# Altium project PIXRACER-R12.PrjPCB
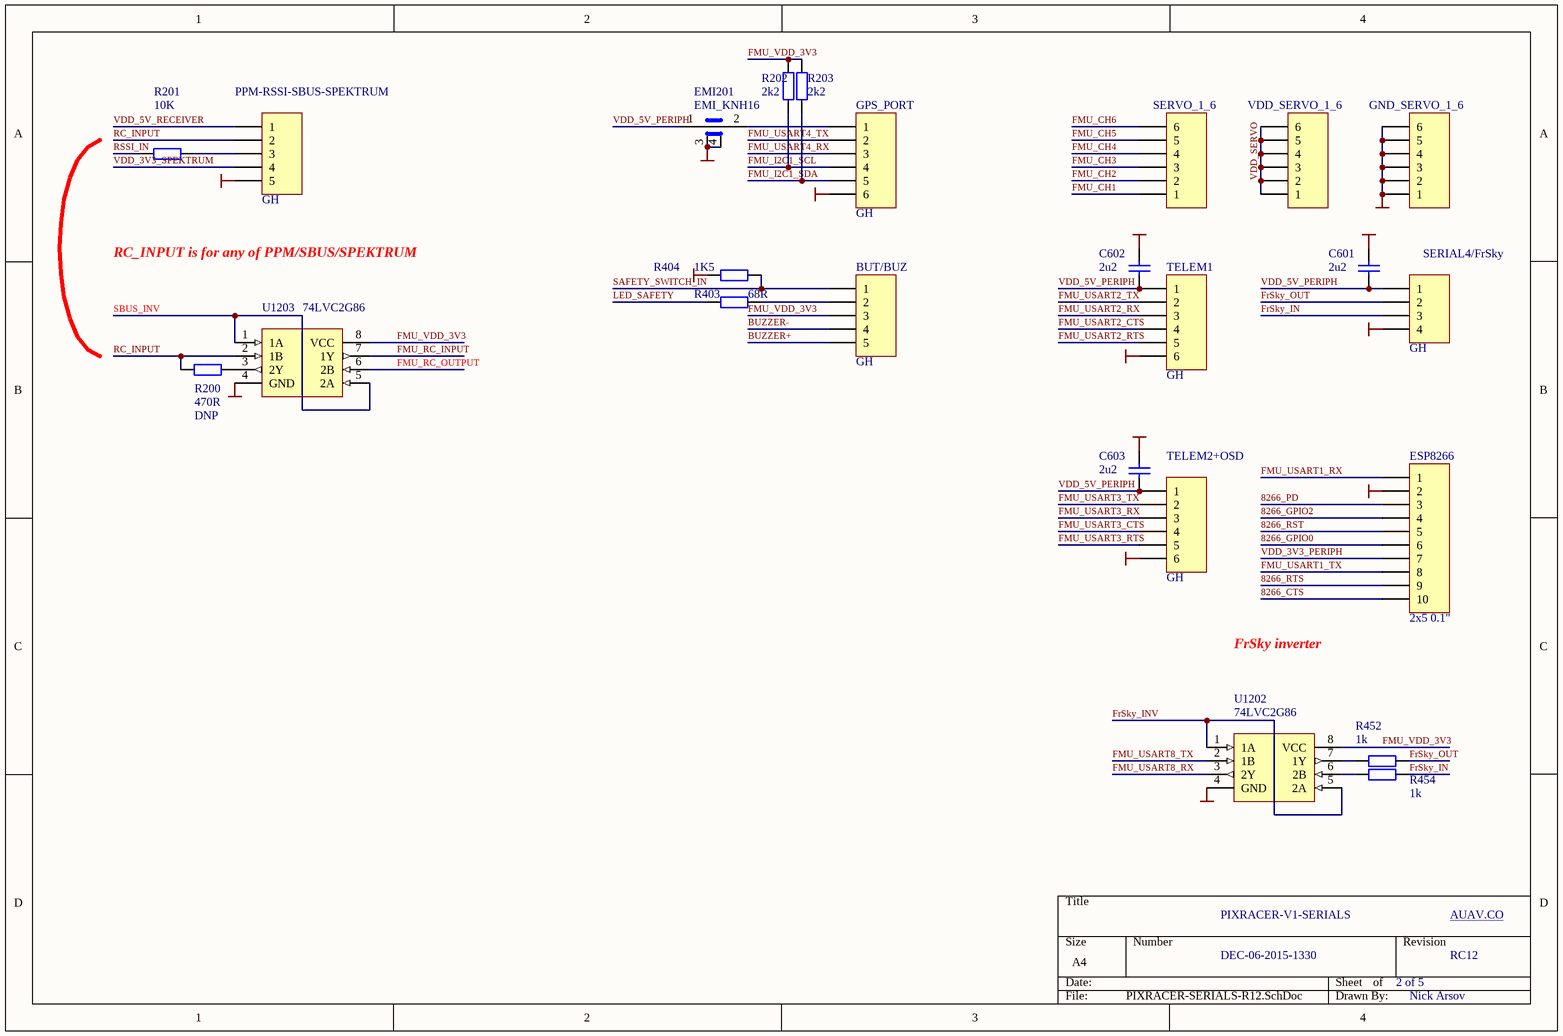
[diagram p0: PIXRACER-SERIALS-R12.SchDoc]
5 sheets, 138 parts. Net scope: global (net labels, ports and power ports of the same name join across sheets).
Board file: PIXRACER-R12.PcbDoc
Sheets:
  PIXRACER-SERIALS-R12.SchDoc
  PIXRACER-SD-USB-R12.SchDoc
  PIXRACER-POWER-R12.SchDoc
  PIXRACER-FMU-R12.SchDoc
  PIXRACER-IMU-R12.SchDoc

## Sheet PIXRACER-SERIALS-R12.SchDoc
size A4

### Parts
BUT/BUZ  GH  [Molex_Clik_1.25_5H]
C601  2u2  [0402A]
C602  2u2  [0402A]
C603  2u2  [0402A]
EMI201  EMI_KNH16  [EMI_KNH16_0603]
ESP8266  2x5 0.1"  [2.54mm_10pin_SMD]
GND_SERVO_1_6  Header 6  [HDR1X6]  (value not drawn)
GPS_PORT  GH  [Molex_Clok_1.25_6H]
PPM-RSSI-SBUS-SPEKTRUM  GH  [Molex_Clik_1.25_5H]
R200  470R  REM: DNP  [0402A]
R201  10K  [0402A]
R202  2k2  [0402A]
R203  2k2  [0402A]
R403  68R  [0402A]
R404  1K5  [0402A]
R452  1k  [0402A]
R454  1k  [0402A]
SERIAL4/FrSky  GH  [Molex_1.25_click_4]
SERVO_1_6  Header 6  [HDR1X6]  (value not drawn)
TELEM1  GH  [Molex_Clok_1.25_6H]
TELEM2+OSD  GH  [Molex_Clok_1.25_6H]
U1202  74LVC2G86  [DCU(SM-8)]
U1203  74LVC2G86  [DCU(SM-8)]
VDD_SERVO_1_6  Header 6  [HDR1X6]  (value not drawn)

### Nets
FMU_VDD_3V3: BUT/BUZ.3 R202.1 R203.1 U1202.8(VCC) U1203.8(VCC)
GND: C601.2 C602.2 C603.2 EMI201.3(G) EMI201.4(G) ESP8266.2 GND_SERVO_1_6.1 GND_SERVO_1_6.2 GND_SERVO_1_6.3 GND_SERVO_1_6.4 GND_SERVO_1_6.5 GND_SERVO_1_6.6 GPS_PORT.6 PPM-RSSI-SBUS-SPEKTRUM.5 R404.2 SERIAL4/FrSky.4 TELEM1.6 TELEM2+OSD.6 U1202.4(GND) U1203.4(GND)
8266_CTS: ESP8266.10
8266_GPIO0: ESP8266.6
8266_GPIO2: ESP8266.4
8266_PD: ESP8266.3
8266_RST: ESP8266.5
8266_RTS: ESP8266.9
BUZZER+: BUT/BUZ.5
BUZZER-: BUT/BUZ.4
FMU_CH1: SERVO_1_6.1
FMU_CH2: SERVO_1_6.2
FMU_CH3: SERVO_1_6.3
FMU_CH4: SERVO_1_6.4
FMU_CH5: SERVO_1_6.5
FMU_CH6: SERVO_1_6.6
FMU_I2C1_SCL: GPS_PORT.4 R202.2
FMU_I2C1_SDA: GPS_PORT.5 R203.2
FMU_RC_INPUT: U1203.7(1Y)
FMU_RC_OUTPUT: U1203.6(2B)
FMU_USART1_RX: ESP8266.1
FMU_USART1_TX: ESP8266.8
FMU_USART2_CTS: TELEM1.4
FMU_USART2_RTS: TELEM1.5
FMU_USART2_RX: TELEM1.3
FMU_USART2_TX: TELEM1.2
FMU_USART3_CTS: TELEM2+OSD.4
FMU_USART3_RTS: TELEM2+OSD.5
FMU_USART3_RX: TELEM2+OSD.3
FMU_USART3_TX: TELEM2+OSD.2
FMU_USART4_RX: GPS_PORT.3
FMU_USART4_TX: GPS_PORT.2
FMU_USART8_RX: U1202.3(2Y)
FMU_USART8_TX: U1202.2(1B)
FrSky_IN: R454.1 SERIAL4/FrSky.3
FrSky_INV: U1202.1(1A) U1202.5(2A)
FrSky_OUT: R452.1 SERIAL4/FrSky.2
LED_SAFETY: R403.2
RC_INPUT: PPM-RSSI-SBUS-SPEKTRUM.2 R200.2 U1203.2(1B)
RSSI_IN: R201.2
SAFETY_SWITCH_IN: BUT/BUZ.1 R404.1
SBUS_INV: U1203.1(1A) U1203.5(2A)
VDD_3V3_PERIPH: ESP8266.7
VDD_3V3_SPEKTRUM: PPM-RSSI-SBUS-SPEKTRUM.4
VDD_5V_PERIPH: C601.1 C602.1 C603.1 EMI201.1(L1) SERIAL4/FrSky.1 TELEM1.1 TELEM2+OSD.1
VDD_5V_RECEIVER: PPM-RSSI-SBUS-SPEKTRUM.1
VDD_SERVO: VDD_SERVO_1_6.1 VDD_SERVO_1_6.2 VDD_SERVO_1_6.3 VDD_SERVO_1_6.4 VDD_SERVO_1_6.5 VDD_SERVO_1_6.6
NetBUT/BUZ_2: BUT/BUZ.2 R403.1
NetEMI201_2: EMI201.2(L2) GPS_PORT.1
NetPPM-RSSI-SBUS-SPEKTRUM_3: PPM-RSSI-SBUS-SPEKTRUM.3 R201.1
NetR200_1: R200.1 U1203.3(2Y)
NetR452_2: R452.2 U1202.7(1Y)
NetR454_2: R454.2 U1202.6(2B)

### Notes on the sheet
- RC_INPUT is for any of PPM/SBUS/SPEKTRUM
- FrSky inverter
- PIXRACER-V1-SERIALS
- AUAV.CO
- DEC-06-2015-1330
- 2 of 5
- RC12
- Nick Arsov

### Library data of the parts
BUT/BUZ PPM-RSSI-SBUS-SPEKTRUM = Header 5: Header, 5-Pin; LatestRevisionDate: 17-Jul-2002; LatestRevisionNote: Re-released for DXP Platform.; Publisher: Altium Limited
C601-C603 = Cap: Capacitor; Value: 100pF; Published: 8-Jun-2000; LatestRevisionDate: 17-Jul-2002; LatestRevisionNote: Re-released for DXP Platform.; PackageReference: RAD-0.3; Publisher: Altium Limited
ESP8266 = Header 10: Header, 10-Pin; LatestRevisionDate: 17-Jul-2002; LatestRevisionNote: Re-released for DXP Platform.; Publisher: Altium Limited
GND_SERVO_1_6 GPS_PORT SERVO_1_6 TELEM1 TELEM2+OSD VDD_SERVO_1_6 = Header 6: Header, 6-Pin; LatestRevisionDate: 17-Jul-2002; LatestRevisionNote: Re-released for DXP Platform.; Publisher: Altium Limited
R200-R203 R403 R404 = Res2: Resistor; Value: 1K; Published: 8-Jun-2000; LatestRevisionDate: 17-Jul-2002; LatestRevisionNote: Re-released for DXP Platform.; PackageReference: AXIAL-0.4; Publisher: Altium Limited
  R202 R203: PackageDescription: Axial Device, Thru-Hole; 2 Leads; 0.4 in Pin Spacing
R452 R454 = Res2: Resistor; Published: 8-Jun-2000; LatestRevisionDate: 17-Jul-2002; LatestRevisionNote: Re-released for DXP Platform.; PackageReference: AXIAL-0.4; Publisher: Altium Limited; PackageDescription: Axial Device, Thru-Hole; 2 Leads; 0.4 in Pin Spacing; Value: 1K
SERIAL4/FrSky = Header 4: Header, 4-Pin; LatestRevisionDate: 17-Jul-2002; LatestRevisionNote: Re-released for DXP Platform.; Publisher: Altium Limited

## Sheet PIXRACER-SD-USB-R12.SchDoc
size A4
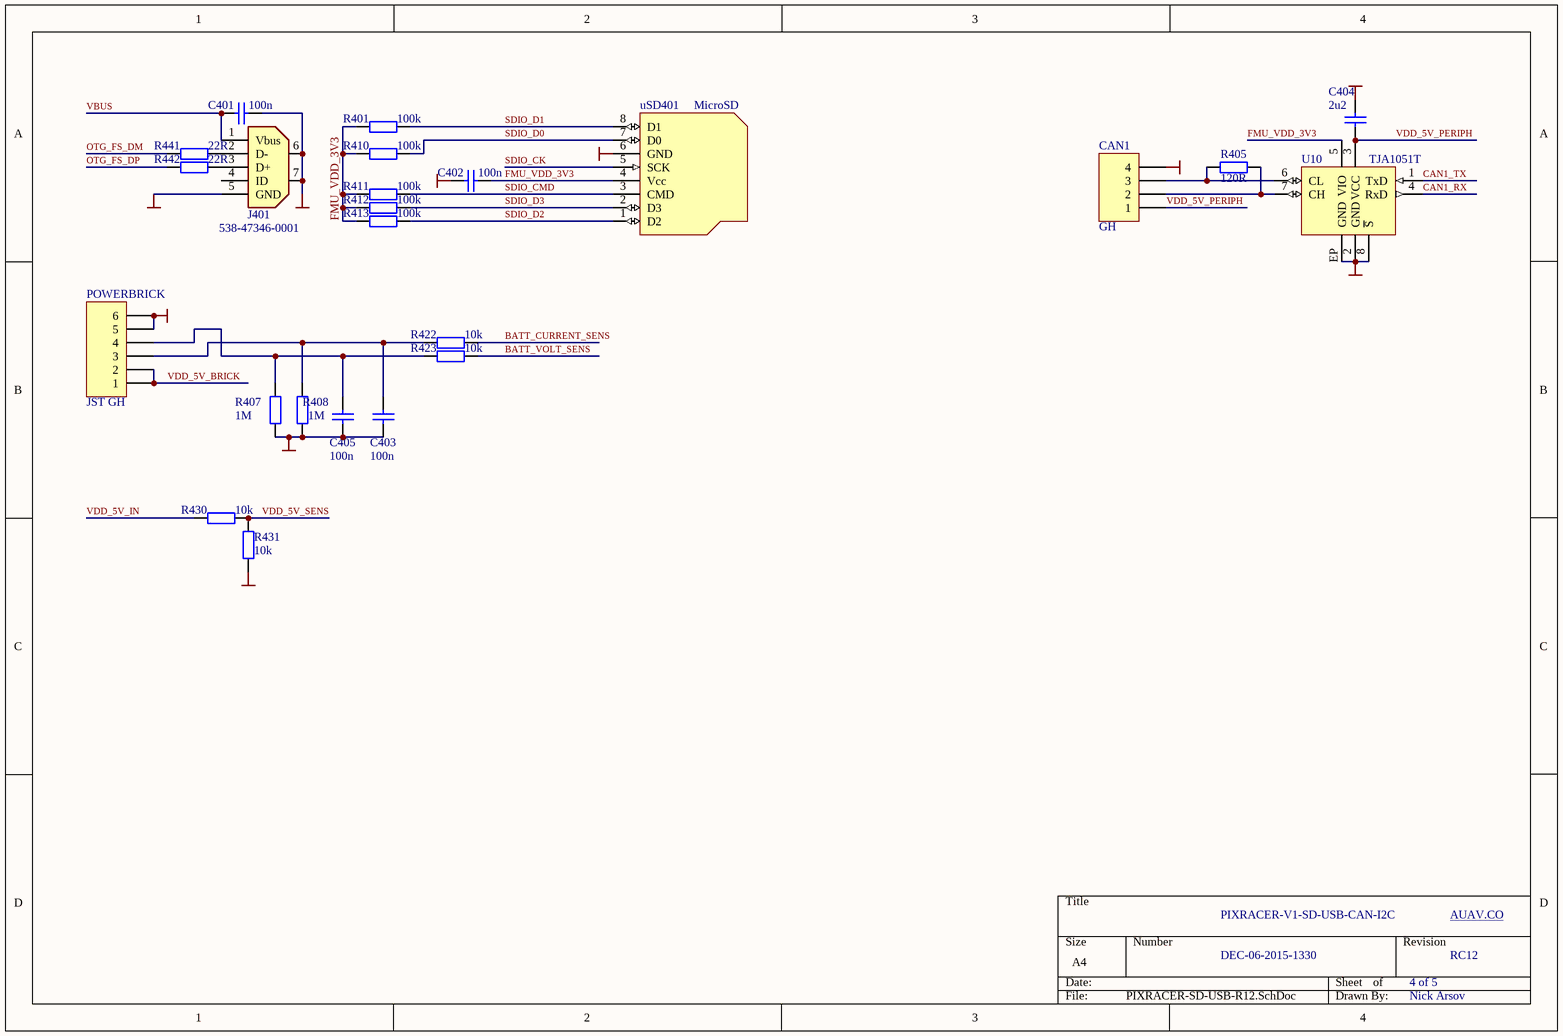
[diagram p1: PIXRACER-SD-USB-R12.SchDoc]

### Parts
C401  100n  [0402A]
C402  100n  [0402A]
C403  100n  [0402A]
C404  2u2  [0603A]
C405  100n  [0402A]
CAN1  GH  [Molex_1.25_click_4]
J401  Mouser Part Number: 538-47346-0001  [USBmicro_B]  (hidden comment: miniUSB)
POWERBRICK  JST GH  [Molex_Clok_1.25_6H]
R401  100k  [0402A]
R405  120R  [0603A]
R407  1M  [0402A]
R408  1M  [0402A]
R410  100k  [0402A]
R411  100k  [0402A]
R412  100k  [0402A]
R413  100k  [0402A]
R422  10k  [0402A]
R423  10k  [0402A]
R430  10k  [0402A]
R431  10k  [0402A]
R441  22R  [0402A]
R442  22R  [0402A]
U10  TJA1051T  [8DFN_3x3]
uSD401  MicroSD  [MicroSD_China_01]

### Nets
FMU_VDD_3V3: C402.1 R401.2 R410.2 R411.2 R412.2 R413.2 U10.5(VIO) uSD401.4(Vcc)
GND: C401.1 C402.2 C403.2 C404.1 C405.2 CAN1.4 J401.5(GND) J401.6(GND) J401.7(GND) POWERBRICK.5 POWERBRICK.6 R407.2 R408.2 R431.2 U10.2(GND) U10.8(~{S}) U10.EP(GND) uSD401.6(GND)
BATT_CURRENT_SENS: R422.1
BATT_VOLT_SENS: R423.1
CAN1_RX: U10.4(RxD)
CAN1_TX: U10.1(TxD)
OTG_FS_DM: R441.2
OTG_FS_DP: R442.2
SDIO_CK: uSD401.5(SCK)
SDIO_CMD: R411.1 uSD401.3(CMD)
SDIO_D0: R410.1 uSD401.7(D0)
SDIO_D1: R401.1 uSD401.8(D1)
SDIO_D2: R413.1 uSD401.1(D2)
SDIO_D3: R412.1 uSD401.2(D3)
VBUS: C401.2 J401.1(Vbus)
VDD_5V_BRICK: POWERBRICK.1 POWERBRICK.2
VDD_5V_IN: R430.2
VDD_5V_PERIPH: C404.2 CAN1.1 U10.3(VCC)
VDD_5V_SENS: R430.1 R431.1
NetC403_1: C403.1 POWERBRICK.3 R408.1 R422.2
NetC405_1: C405.1 POWERBRICK.4 R407.1 R423.2
NetCAN1_2: CAN1.2 R405.1 U10.7(CH)
NetCAN1_3: CAN1.3 R405.2 U10.6(CL)
NetJ401_2: J401.2(D-) R441.1
NetJ401_3: J401.3(D+) R442.1

Not connected (* = marked no-connect by the designer): J401 4(ID)

### Notes on the sheet
- PIXRACER-V1-SD-USB-CAN-I2C
- AUAV.CO
- DEC-06-2015-1330
- 4 of 5
- RC12
- Nick Arsov

### Library data of the parts
C401-C405 = Cap: Capacitor; Value: 100pF; Published: 8-Jun-2000; LatestRevisionDate: 17-Jul-2002; LatestRevisionNote: Re-released for DXP Platform.; PackageReference: RAD-0.3; Publisher: Altium Limited
CAN1 = Header 4: Header, 4-Pin; LatestRevisionDate: 17-Jul-2002; LatestRevisionNote: Re-released for DXP Platform.; Publisher: Altium Limited
J401 = MicroUSB
POWERBRICK = Header 6: Header, 6-Pin; LatestRevisionDate: 17-Jul-2002; LatestRevisionNote: Re-released for DXP Platform.; Publisher: Altium Limited
R401 R405 R407 R408 R410-R413 R422 R423 R430 R431 R441 R442 = Res2: Resistor; Value: 1K; Published: 8-Jun-2000; LatestRevisionDate: 17-Jul-2002; LatestRevisionNote: Re-released for DXP Platform.; PackageReference: AXIAL-0.4; Publisher: Altium Limited
  R401 R407 R408 R410-R413 R422 R423 R430 R431 R441 R442: PackageDescription: Axial Device, Thru-Hole; 2 Leads; 0.4 in Pin Spacing

## Sheet PIXRACER-POWER-R12.SchDoc
size A4
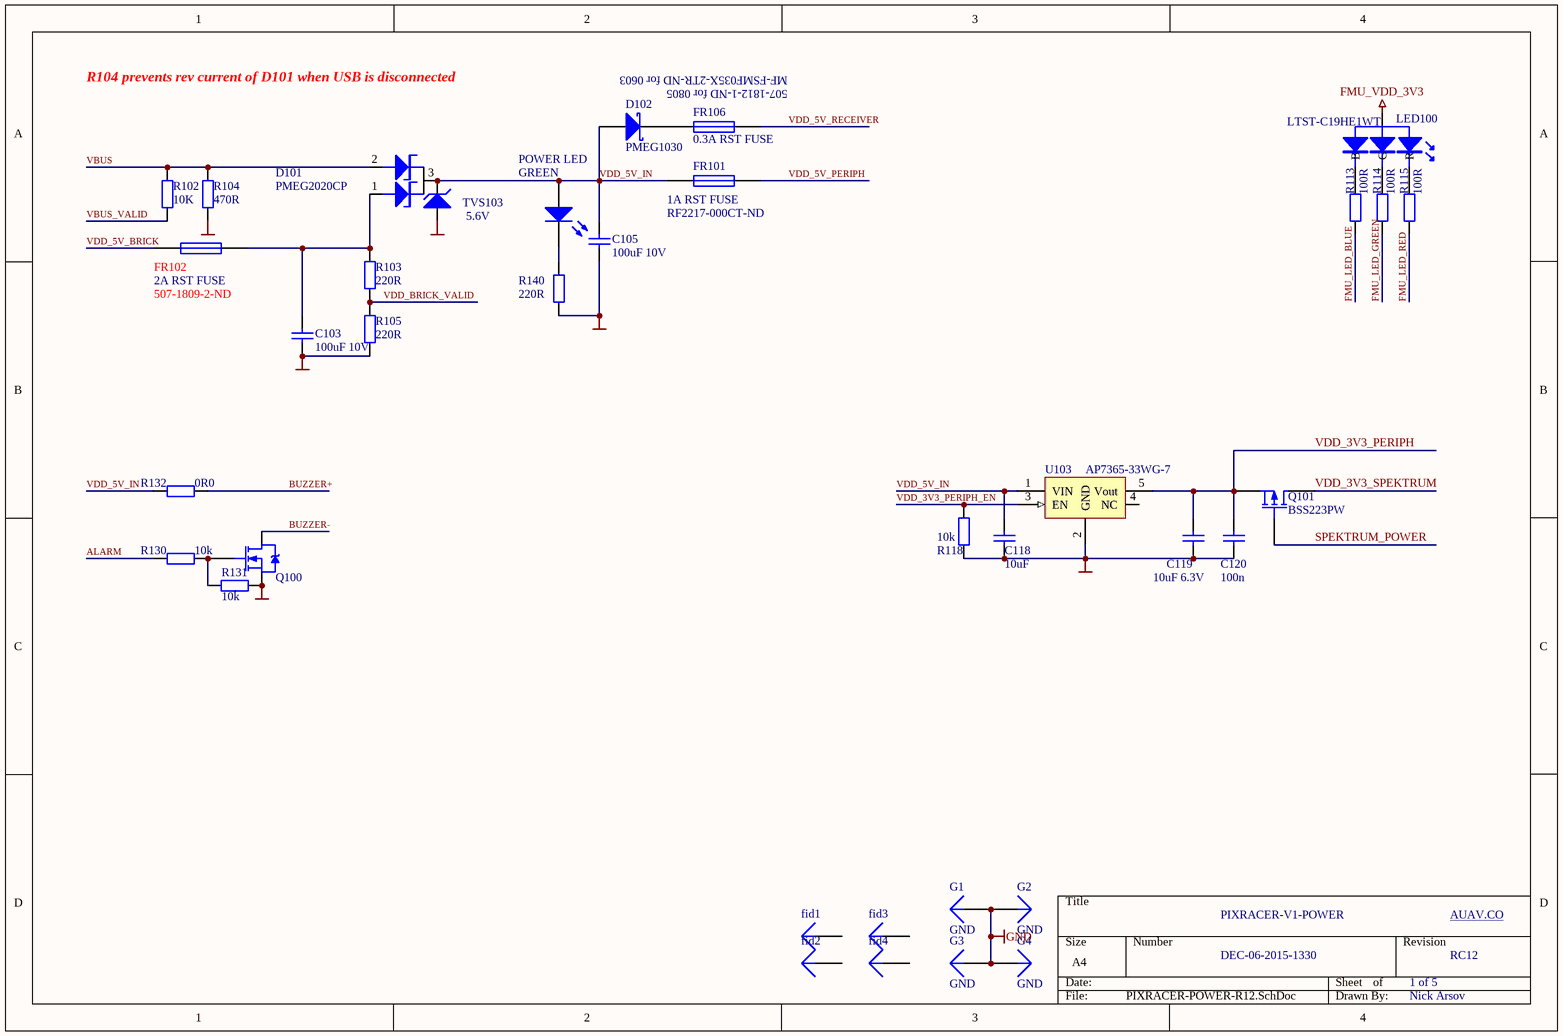
[diagram p2: PIXRACER-POWER-R12.SchDoc]

### Parts
C103  100uF 10V  [0805A]
C105  100uF 10V  [0805A]
C118  10uF  [0603A]
C119  10uF 6.3V  [0603A]
C120  100n  [0603A]
D101  PMEG2020CP  [pmeg2020cp]
D102  PMEG1030  [sod323f]
fid1  (no value)  [SMT_PAD]
fid2  (no value)  [SMT_PAD]
fid3  (no value)  [SMT_PAD]
fid4  (no value)  [SMT_PAD]
FR101  1A RST FUSE  DigiKey: RF2217-000CT-ND  [0805A]
FR102  2A RST FUSE  DigiKey: 507-1809-2-ND  [1206A]
FR106  0.3A RST FUSE  [0805A]
G1  GND
G2  GND
G3  GND
G4  GND
LED100  LTST-C19HE1WT  [LTST-C19HE1WT]
POWER_LED  GREEN  [0603A]
Q100  DMG1012UW  [2N7002-SOT323]  (value not drawn)
Q101  BSS223PW  [2N7002-SOT323]
R102  10K  [0603A]
R103  220R  [0603A]
R104  470R  [0603A]
R105  220R  [0603A]
R113  100R  [0402A]
R114  100R  [0402A]
R115  100R  [0402A]
R118  10k  [0603A]
R130  10k  [0402A]
R131  10k  [0402A]
R132  0R0  [0402A]
R140  220R  [0603A]
TVS103  5.6V  [SOD123F]
U103  AP7365-33WG-7  [SOT23-5]

### Nets
FMU_VDD_3V3: LED100.4(A)
GND: C103.1 C105.1 C118.1 C119.1 C120.1 G1.1 G2.1 G3.1 G4.1 Q100.2(S) R104.1 R105.2 R118.1 R131.2 R140.1 TVS103.1(A) U103.2(GND)
ALARM: R130.2
BUZZER+: R132.1
BUZZER-: Q100.1(D)
FMU_LED_BLUE: R113.1
FMU_LED_GREEN: R114.1
FMU_LED_RED: R115.1
SPEKTRUM_POWER: Q101.3(G)
VBUS: D101.2 R102.2 R104.2
VBUS_VALID: R102.1
VDD_3V3_PERIPH: C119.2 C120.2 Q101.2(S) U103.5(Vout)
VDD_3V3_PERIPH_EN: R118.2 U103.3(EN)
VDD_3V3_SPEKTRUM: Q101.1(D)
VDD_5V_BRICK: FR102.1
VDD_5V_IN: C105.2 C118.2 D101.3 D102.1(A) FR101.1 POWER_LED.1(A) R132.2 TVS103.2(K) U103.1(VIN)
VDD_5V_PERIPH: FR101.2
VDD_5V_RECEIVER: FR106.2
VDD_BRICK_VALID: R103.2 R105.1
NetC103_2: C103.2 D101.1 FR102.2 R103.1
NetD102_2: D102.2(K) FR106.1
NetLED100_1: LED100.1(R) R115.2
NetLED100_2: LED100.2(G) R114.2
NetLED100_3: LED100.3(B) R113.2
NetPOWER_LED_2: POWER_LED.2(K) R140.2
NetQ100_3: Q100.3(G) R130.1 R131.1

Not connected (* = marked no-connect by the designer): fid1 1; fid2 1; fid3 1; fid4 1; U103 4(NC)

### Notes on the sheet
- R104 prevents rev current of D101 when USB is disconnected
- 507-1812-1-ND for 0805
- MF-FSMF035X-2TR-ND for 0603
- PIXRACER-V1-POWER
- AUAV.CO
- DEC-06-2015-1330
- 1 of 5
- RC12
- Nick Arsov

### Library data of the parts
C103 C105 C118-C120 = Cap: Capacitor; Value: 100pF; Published: 8-Jun-2000; LatestRevisionDate: 17-Jul-2002; LatestRevisionNote: Re-released for DXP Platform.; PackageReference: RAD-0.3; Publisher: Altium Limited; PackageDescription: Radial Cap, Thru-Hole; 2 Leads; 0.3 in Pin Spacing
D102 = D Schottky: Schottky Diode; Published: 8-Jun-2000; LatestRevisionDate: 17-Jul-2002; LatestRevisionNote: Re-released for DXP Platform.; PackageReference: SMB; Publisher: Altium Limited; PackageDescription: DO-214-AA/SMB; 2 C-Bend Leads; Body 5.3 x 3.6 mm, inc. leads (LxW); Code_JEDEC: DO-214-AA
fid1-fid4 G1-G4 = Plug: LatestRevisionDate: 17-Jul-2002; LatestRevisionNote: Re-released for DXP Platform.; Publisher: Altium Limited
FR101 FR102 FR106 = Fuse 1: Fuse; Published: 8-Jun-2000; LatestRevisionDate: 17-Jul-2002; LatestRevisionNote: Re-released for DXP Platform.; PackageReference: PIN-W2/E2.8; Publisher: Altium Limited; PackageDescription: Thru-Hole; 2 Leads
LED100 = RGB_LED_5MM
POWER_LED = LED0: Typical INFRARED GaAs LED; Published: 8-Jun-2000; LatestRevisionDate: 08-Jul-2005; LatestRevisionNote: Mech Layer 1 removed.; PackageReference: LED-0; Publisher: Altium Limited; PackageDescription: LED; 2 Leads
Q100 = NMOS-2: N-Channel Power MOSFET; Note: Pin 2 is electrically connected to pin 4.; Published: 8-Jun-2000; LatestRevisionDate: 17-Jul-2002; LatestRevisionNote: Re-released for DXP Platform.; DatasheetDocument: PD-9.814; PackageReference: TO-220AB; Publisher: Altium Limited; Code_JEDEC: TO-220-AB; ComponentLink1Description: Manufacturer Link; ComponentLink1URL: http://www.irf.com/
Q101 = MOSFET-P: P-Channel MOSFET; Published: 8-Jun-2000; LatestRevisionDate: 17-Jul-2002; LatestRevisionNote: Re-released for DXP Platform.; PackageVersion: 1995/1996; PackageReference: E3; Publisher: Altium Limited; PackageDescription: TO, Flat Index; 3 In-Line, Axial Leads; Body Dia. 4.6mm; Lead Dia. 0.5 mm (max)
R102-R105 R113-R115 R118 R130-R132 R140 = Res2: Resistor; Value: 1K; Published: 8-Jun-2000; LatestRevisionDate: 17-Jul-2002; LatestRevisionNote: Re-released for DXP Platform.; PackageReference: AXIAL-0.4; Publisher: Altium Limited
  R102-R105 R118 R130-R132 R140: PackageDescription: Axial Device, Thru-Hole; 2 Leads; 0.4 in Pin Spacing
TVS103 = D Zener: Zener Diode; Published: 8-Jun-2000; LatestRevisionDate: 17-Jul-2002; LatestRevisionNote: Re-released for DXP Platform.; PackageReference: DIODE-0.7; Publisher: Altium Limited; PackageDescription: Diode, Thru-Hole; 2 Leads; 0.7 in Pin Spacing
U103 = LP5907-Q1

## Sheet PIXRACER-FMU-R12.SchDoc
size A4
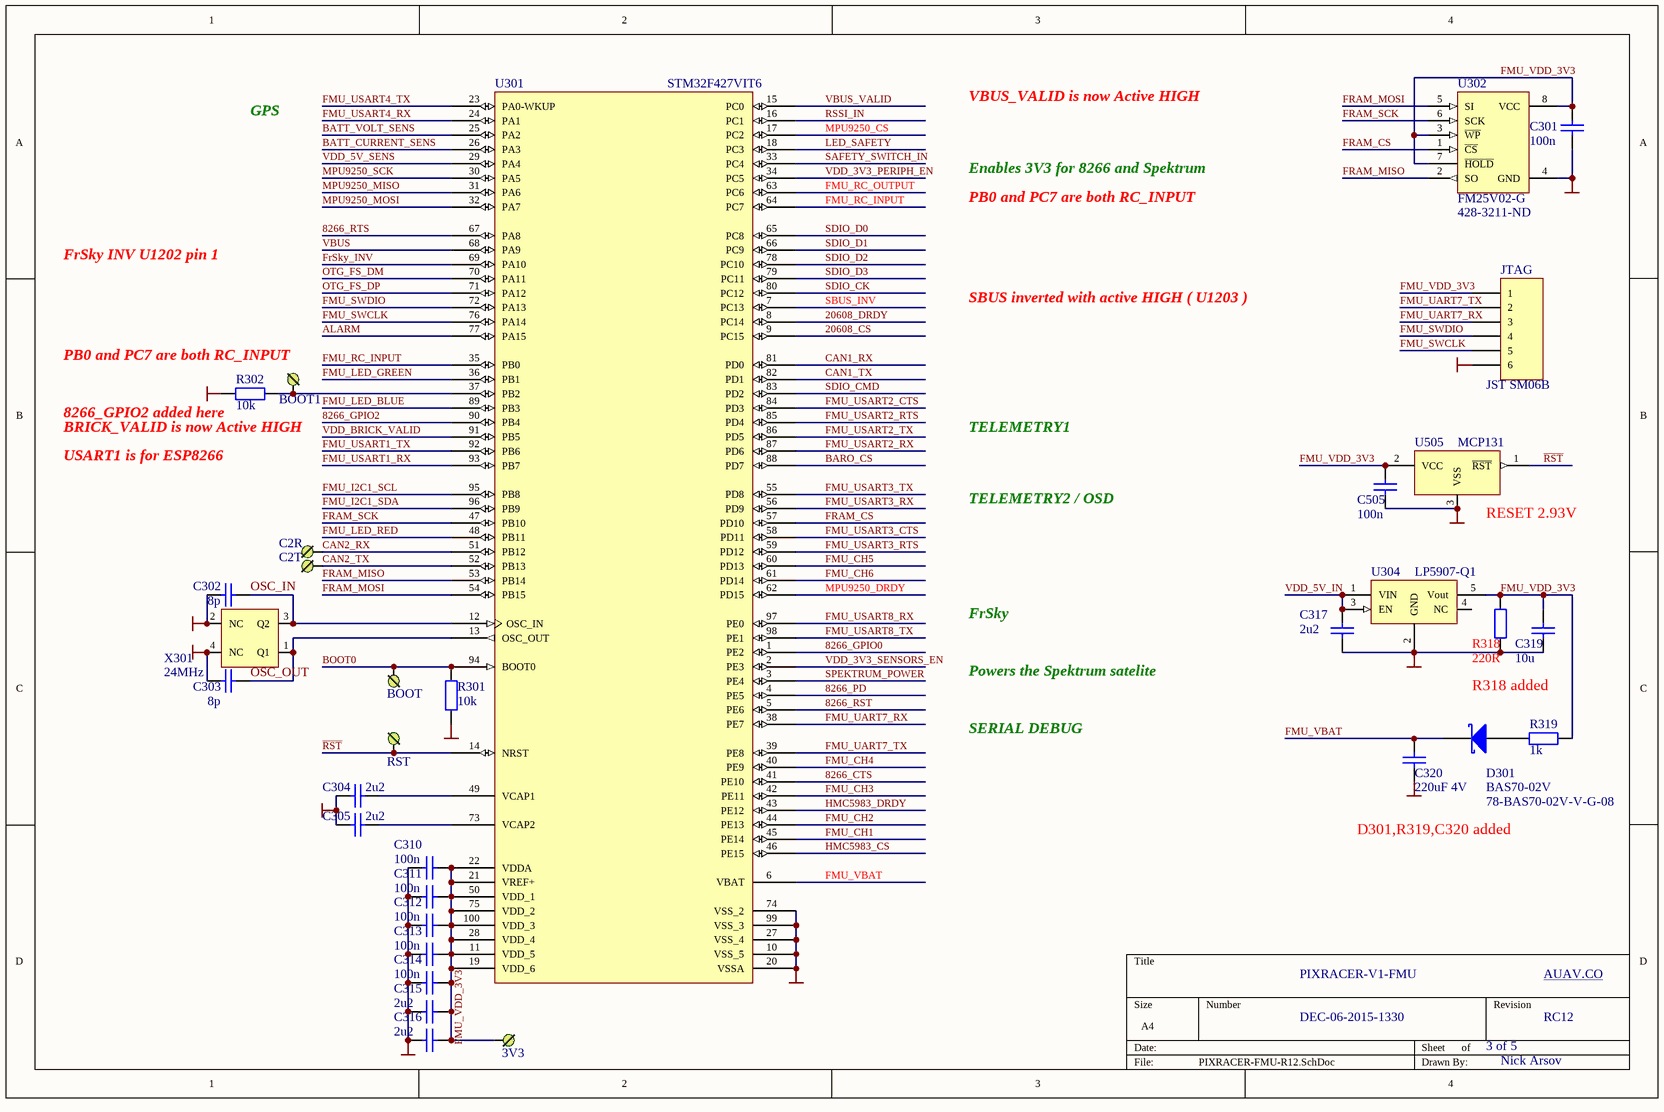
[diagram p3: PIXRACER-FMU-R12.SchDoc]

### Parts
3V3  3V3  [PAD1]  (value not drawn)
BOOT  BOOT  [PAD1]  (value not drawn)
BOOT1  BOOT1  [PAD1]  (value not drawn)
C2R  CAN2_RX  [PAD1]  (value not drawn)
C2T  CAN2_TX  [PAD1]  (value not drawn)
C301  100n  [0402A]
C302  8p  [0603A]
C303  8p  [0603A]
C304  2u2  [0402A]
C305  2u2  [0402A]
C310  100n  [0402A]
C311  100n  [0402A]
C312  100n  [0402A]
C313  100n  [0402A]
C314  100n  [0402A]
C315  2u2  [0402A]
C316  2u2  [0402A]
C317  2u2  [0603A]
C319  10u  [0603A]
C320  220uF 4V  [1206A]
C505  100n  [0402A]
D301  BAS70-02V  Mouser: 78-BAS70-02V-V-G-08  [SOD-523]
JTAG  JST SM06B  [SM06B-SRSH-TB]
R301  10k  [0402A]
R302  10k  [0402A]
R318  220R  [0603A]
R319  1k  [0603A]
RST  BOOT  [PAD1]  (value not drawn)
U301  STM32F427VIT6  [LQFP100_L]
U302  FM25V02-G  Supplier Part Number: 428-3211-ND  [SO-8_N]
U304  LP5907-Q1  [SOT23-5]
U505  MCP131  [SOT-323]
X301  24MHz  [Crystal_2.5x2]

### Nets
FMU_VDD_3V3: 3V3.1 C301.2 C310.2 C311.2 C312.2 C313.2 C314.2 C315.2 C316.2 C319.2 C505.2 JTAG.1 R318.2 R319.1 U301.11(VDD_5) U301.19(VDD_6) U301.21(VREF+) U301.22(VDDA) U301.28(VDD_4) U301.50(VDD_1) U301.75(VDD_2) U301.100(VDD_3) U302.3(~{WP}) U302.7(~{HOLD}) U302.8(VCC) U304.5(Vout) U505.2(VCC)
GND: C301.1 C302.1 C303.1 C304.2 C305.2 C310.1 C311.1 C312.1 C313.1 C314.1 C315.1 C316.1 C317.1 C319.1 C320.1 C505.1 JTAG.6 R301.2 R302.1 R318.1 U301.10(VSS_5) U301.20(VSSA) U301.27(VSS_4) U301.74(VSS_2) U301.99(VSS_3) U302.4(GND) U304.2(GND) U505.3(VSS) X301.2(NC) X301.4(NC)
8266_CTS: U301.41(PE10)
8266_GPIO0: U301.1(PE2)
8266_GPIO2: U301.90(PB4)
8266_PD: U301.4(PE5)
8266_RST: U301.5(PE6)
8266_RTS: U301.67(PA8)
20608_CS: U301.9(PC15)
20608_DRDY: U301.8(PC14)
~{RST}: RST.1 U301.14(NRST) U505.1(~{RST})
ALARM: U301.77(PA15)
BARO_CS: U301.88(PD7)
BATT_CURRENT_SENS: U301.26(PA3)
BATT_VOLT_SENS: U301.25(PA2)
BOOT0: BOOT.1 R301.1 U301.94(BOOT0)
CAN1_RX: U301.81(PD0)
CAN1_TX: U301.82(PD1)
CAN2_RX: C2R.1 U301.51(PB12)
CAN2_TX: C2T.1 U301.52(PB13)
FMU_CH1: U301.45(PE14)
FMU_CH2: U301.44(PE13)
FMU_CH3: U301.42(PE11)
FMU_CH4: U301.40(PE9)
FMU_CH5: U301.60(PD13)
FMU_CH6: U301.61(PD14)
FMU_I2C1_SCL: U301.95(PB8)
FMU_I2C1_SDA: U301.96(PB9)
FMU_LED_BLUE: U301.89(PB3)
FMU_LED_GREEN: U301.36(PB1)
FMU_LED_RED: U301.48(PB11)
FMU_RC_INPUT: U301.35(PB0) U301.64(PC7)
FMU_RC_OUTPUT: U301.63(PC6)
FMU_SWCLK: JTAG.5 U301.76(PA14)
FMU_SWDIO: JTAG.4 U301.72(PA13)
FMU_UART7_RX: JTAG.3 U301.38(PE7)
FMU_UART7_TX: JTAG.2 U301.39(PE8)
FMU_USART1_RX: U301.93(PB7)
FMU_USART1_TX: U301.92(PB6)
FMU_USART2_CTS: U301.84(PD3)
FMU_USART2_RTS: U301.85(PD4)
FMU_USART2_RX: U301.87(PD6)
FMU_USART2_TX: U301.86(PD5)
FMU_USART3_CTS: U301.58(PD11)
FMU_USART3_RTS: U301.59(PD12)
FMU_USART3_RX: U301.56(PD9)
FMU_USART3_TX: U301.55(PD8)
FMU_USART4_RX: U301.24(PA1)
FMU_USART4_TX: U301.23(PA0-WKUP)
FMU_USART8_RX: U301.97(PE0)
FMU_USART8_TX: U301.98(PE1)
FMU_VBAT: C320.2 D301.2(K) U301.6(VBAT)
FRAM_CS: U301.57(PD10) U302.1(~{CS})
FRAM_MISO: U301.53(PB14) U302.2(SO)
FRAM_MOSI: U301.54(PB15) U302.5(SI)
FRAM_SCK: U301.47(PB10) U302.6(SCK)
FrSky_INV: U301.69(PA10)
HMC5983_CS: U301.46(PE15)
HMC5983_DRDY: U301.43(PE12)
LED_SAFETY: U301.18(PC3)
MPU9250_CS: U301.17(PC2)
MPU9250_DRDY: U301.62(PD15)
MPU9250_MISO: U301.31(PA6)
MPU9250_MOSI: U301.32(PA7)
MPU9250_SCK: U301.30(PA5)
OSC_IN: C302.2 U301.12(OSC_IN) X301.3(Q2)
OSC_OUT: C303.2 U301.13(OSC_OUT) X301.1(Q1)
OTG_FS_DM: U301.70(PA11)
OTG_FS_DP: U301.71(PA12)
RSSI_IN: U301.16(PC1)
SAFETY_SWITCH_IN: U301.33(PC4)
SBUS_INV: U301.7(PC13)
SDIO_CK: U301.80(PC12)
SDIO_CMD: U301.83(PD2)
SDIO_D0: U301.65(PC8)
SDIO_D1: U301.66(PC9)
SDIO_D2: U301.78(PC10)
SDIO_D3: U301.79(PC11)
SPEKTRUM_POWER: U301.3(PE4)
VBUS: U301.68(PA9)
VBUS_VALID: U301.15(PC0)
VDD_3V3_PERIPH_EN: U301.34(PC5)
VDD_3V3_SENSORS_EN: U301.2(PE3)
VDD_5V_IN: C317.2 U304.1(VIN) U304.3(EN)
VDD_5V_SENS: U301.29(PA4)
VDD_BRICK_VALID: U301.91(PB5)
NetBOOT1_1: BOOT1.1 R302.2 U301.37(PB2)
NetC304_1: C304.1 U301.49(VCAP1)
NetC305_1: C305.1 U301.73(VCAP2)
NetD301_1: D301.1(A) R319.2

Not connected (* = marked no-connect by the designer): U304 4(NC)

### Notes on the sheet
- GPS
- VBUS_VALID is now Active HIGH
- Enables 3V3 for 8266 and Spektrum
- FrSky INV U1202 pin 1
- PB0 and PC7 are both RC_INPUT
- SBUS inverted with active HIGH ( U1203 )
- (near BOOT1) PB0 and PC7 are both RC_INPUT
- (near R302) USART1 is for ESP8266
- BRICK_VALID is now Active HIGH
- (near R302) 8266_GPIO2 added here
- TELEMETRY1
- TELEMETRY2 / OSD
- (near U505) RESET 2.93V
- FrSky
- Powers the Spektrum satelite
- R318 added
- SERIAL DEBUG
- D301,R319,C320 added
- PIXRACER-V1-FMU
- AUAV.CO
- DEC-06-2015-1330
- 3 of 5
- RC12
- Nick Arsov

### Library data of the parts
3V3 BOOT BOOT1 C2R C2T RST = PLUG
C301-C305 C310-C317 C319 C320 C505 = Cap: Capacitor; Value: 100pF; Published: 8-Jun-2000; LatestRevisionDate: 17-Jul-2002; LatestRevisionNote: Re-released for DXP Platform.; PackageReference: RAD-0.3; Publisher: Altium Limited
  C320: PackageDescription: Radial Cap, Thru-Hole; 2 Leads; 0.3 in Pin Spacing
D301 = D Schottky: Schottky Diode; Published: 8-Jun-2000; LatestRevisionDate: 17-Jul-2002; LatestRevisionNote: Re-released for DXP Platform.; PackageReference: SMB; Publisher: Altium Limited; PackageDescription: DO-214-AA/SMB; 2 C-Bend Leads; Body 5.3 x 3.6 mm, inc. leads (LxW); Code_JEDEC: DO-214-AA
JTAG = Header 6: Header, 6-Pin; LatestRevisionDate: 17-Jul-2002; LatestRevisionNote: Re-released for DXP Platform.; Publisher: Altium Limited
R301 R302 R318 = Res2: Resistor; Value: 1K; Published: 8-Jun-2000; LatestRevisionDate: 17-Jul-2002; LatestRevisionNote: Re-released for DXP Platform.; PackageReference: AXIAL-0.4; Publisher: Altium Limited; PackageDescription: Axial Device, Thru-Hole; 2 Leads; 0.4 in Pin Spacing
R319 = Res2: Resistor; Published: 8-Jun-2000; LatestRevisionDate: 17-Jul-2002; LatestRevisionNote: Re-released for DXP Platform.; PackageReference: AXIAL-0.4; Publisher: Altium Limited; PackageDescription: Axial Device, Thru-Hole; 2 Leads; 0.4 in Pin Spacing; Value: 1K
U301 = STM32F103VBT6: STM32 ARM-based 32-bit MCU with 64 Kbytes Flash, 100-pin LQFP, Industrial Temperature; Published: 30-May-2008; DatasheetVersion: rev6, Mar-2008; PackageVersion: Mar-2008; PackageReference: LQFP100; Publisher: Altium Limited; PackageDescription: 100-Pin Low-Profile Quad Flat Pack, 14 x 14 mm Body, 0.5 mm Pitch (LQFP100); ComponentLink1Description: Manufacturer Link; ComponentLink1URL: www.st.com/stm32; ComponentLink2Description: Datasheet; ComponentLink2URL: http://www.st.com/stonline/products/literature/ds/13587.pdf
U302 = AT45DB161D-MU
U505 = MCP102
X301 = Crystal_4pin: Supplier Part Number: 644-1052-1-ND

## Sheet PIXRACER-IMU-R12.SchDoc
size A4; PageSetup: Record=PageOptions|CenterHorizontal=True|CenterVertical=True|PrintScale=0.97|XCorrection=1.00|YCorrection=1.00|PrintKind=2|BorderSize=5000000|LeftOffset=0|BottomOffset=0|Orientation=2|PaperLength=1000|PaperWidth=1000|Scale=100|PaperSource=7|PrintQuality=-4|MediaType=1|DitherType=10|PaperKind=A4|PrintScaleMode=1
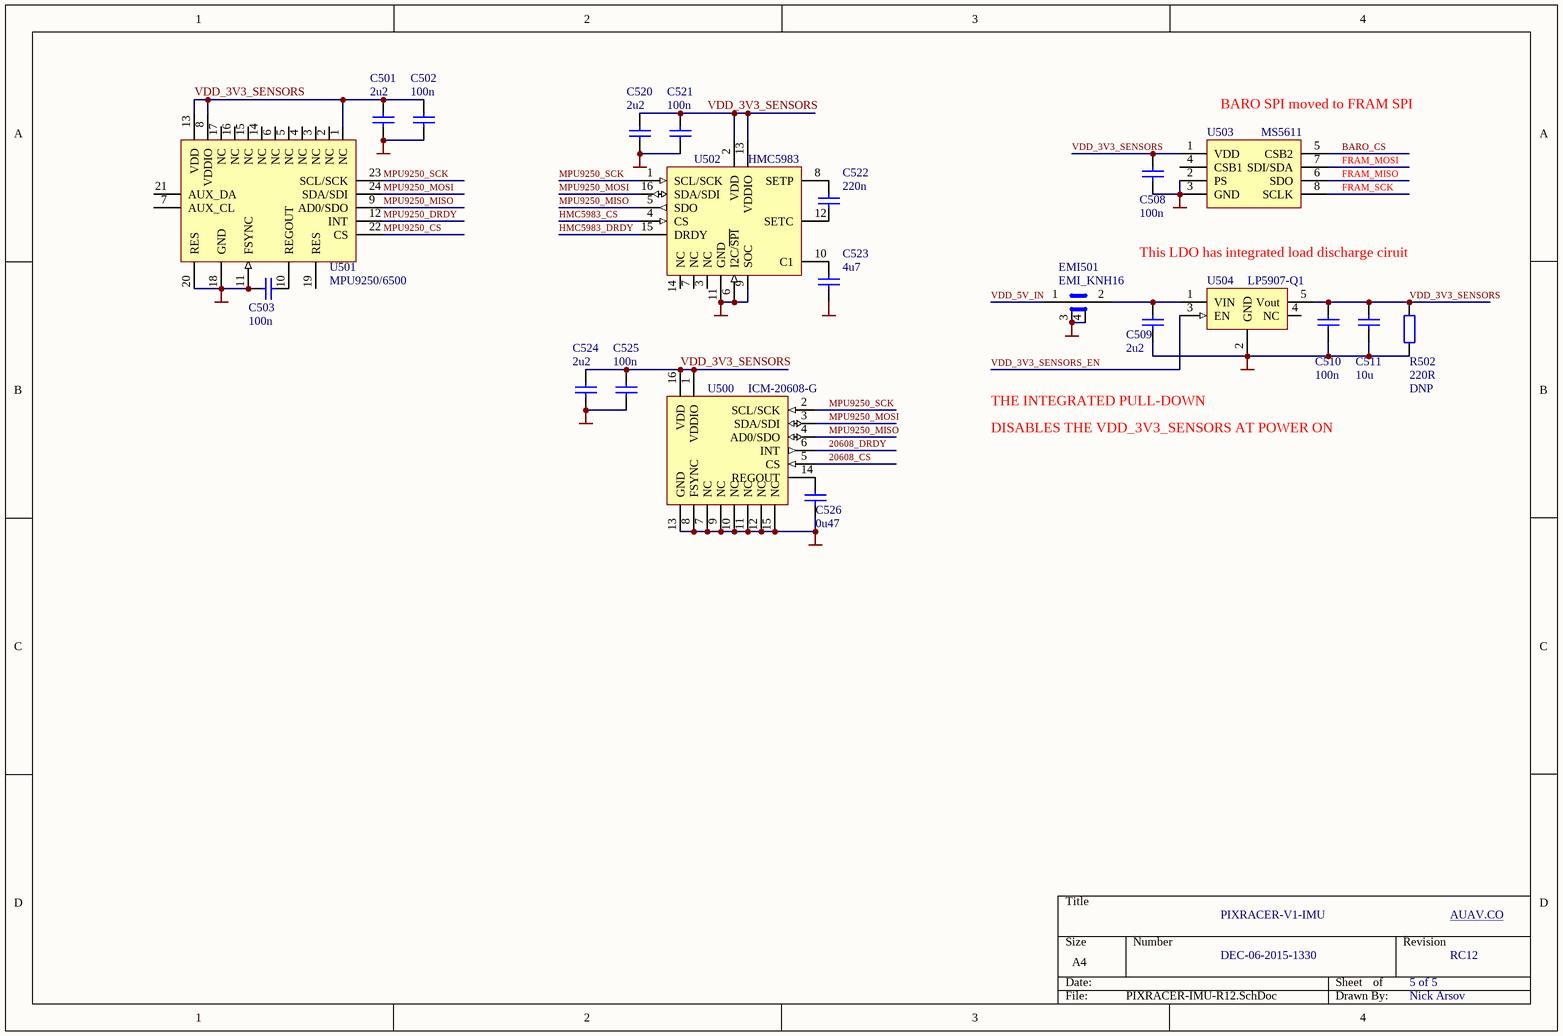
[diagram p4: PIXRACER-IMU-R12.SchDoc]

### Parts
C501  2u2  [0402A]
C502  100n  [0402A]
C503  100n  [0402A]
C508  100n  [0402A]
C509  2u2  [0603A]
C510  100n  [0603A]
C511  10u  [0603A]
C520  2u2  [0402A]
C521  100n  [0402A]
C522  220n  [0402A]
C523  4u7  [0603A]
C524  2u2  [0402A]
C525  100n  [0402A]
C526  0u47  [0402A]
EMI501  EMI_KNH16  [EMI_KNH16_0603]
R502  220R  REM: DNP  [0402A]
U500  ICM-20608-G  [HCLGA-16L]
U501  MPU9250/6500  [QFN24_3x3]
U502  HMC5983  [HMC5883L]
U503  MS5611  [MS5611]
U504  LP5907-Q1  [SOT23-5]

### Nets
GND: C501.1 C502.1 C503.1 C508.1 C509.1 C510.1 C511.1 C520.1 C521.1 C523.1 C524.1 C525.1 C526.1 EMI501.3(G) EMI501.4(G) R502.1 U500.7(NC) U500.8(FSYNC) U500.9(NC) U500.10(NC) U500.11(NC) U500.12(NC) U500.13(GND) U500.15(NC) U501.11(FSYNC) U501.18(GND) U501.20(RES) U502.6(I2C/~{SPI}) U502.9(SOC) U502.11(GND) U503.2(PS) U503.3(GND) U504.2(GND)
20608_CS: U500.5(CS)
20608_DRDY: U500.6(INT)
BARO_CS: U503.5(CSB2)
FRAM_MISO: U503.6(SDO)
FRAM_MOSI: U503.7(SDI/SDA)
FRAM_SCK: U503.8(SCLK)
HMC5983_CS: U502.4(CS)
HMC5983_DRDY: U502.15(DRDY)
MPU9250_CS: U501.22(CS)
MPU9250_DRDY: U501.12(INT)
MPU9250_MISO: U500.4(AD0/SDO) U501.9(AD0/SDO) U502.5(SDO)
MPU9250_MOSI: U500.3(SDA/SDI) U501.24(SDA/SDI) U502.16(SDA/SDI)
MPU9250_SCK: U500.2(SCL/SCK) U501.23(SCL/SCK) U502.1(SCL/SCK)
VDD_3V3_SENSORS: C501.2 C502.2 C508.2 C510.2 C511.2 C520.2 C521.2 C524.2 C525.2 R502.2 U500.1(VDDIO) U500.16(VDD) U501.1(NC) U501.8(VDDIO) U501.13(VDD) U502.2(VDD) U502.13(VDDIO) U503.1(VDD) U504.5(Vout)
VDD_3V3_SENSORS_EN: U504.3(EN)
VDD_5V_IN: EMI501.1(L1)
NetC503_2: C503.2 U501.10(REGOUT)
NetC509_2: C509.2 EMI501.2(L2) U504.1(VIN)
NetC522_1: C522.1 U502.12(SETC)
NetC522_2: C522.2 U502.8(SETP)
NetC523_2: C523.2 U502.10(C1)
NetC526_2: C526.2 U500.14(REGOUT)

Not connected (* = marked no-connect by the designer): U501 2(NC) 3(NC) 4(NC) 5(NC) 6(NC) 7(AUX_CL) 14(NC) 15(NC) 16(NC) 17(NC) 19(RES) 21(AUX_DA); U502 3(NC) 7(NC) 14(NC); U503 4(CSB1); U504 4(NC)

### Notes on the sheet
- (near U503) BARO SPI moved to FRAM SPI
- This LDO has integrated load discharge ciruit
- THE INTEGRATED PULL-DOWN
- DISABLES THE VDD_3V3_SENSORS AT POWER ON
- PIXRACER-V1-IMU
- AUAV.CO
- DEC-06-2015-1330
- 5 of 5
- RC12
- Nick Arsov

### Library data of the parts
C501-C503 C508-C511 C520-C526 = Cap: Capacitor; Value: 100pF; Published: 8-Jun-2000; LatestRevisionDate: 17-Jul-2002; LatestRevisionNote: Re-released for DXP Platform.; PackageReference: RAD-0.3; Publisher: Altium Limited
R502 = Res2: Resistor; Value: 1K; Published: 8-Jun-2000; LatestRevisionDate: 17-Jul-2002; LatestRevisionNote: Re-released for DXP Platform.; PackageReference: AXIAL-0.4; Publisher: Altium Limited; PackageDescription: Axial Device, Thru-Hole; 2 Leads; 0.4 in Pin Spacing
U501 = MPU6500
U503 = MS5611-01BA03

## Nets that join several sheets
FMU_VDD_3V3: PIXRACER-SERIALS-R12 (5 pins), PIXRACER-SD-USB-R12 (8 pins), PIXRACER-POWER-R12 (LED100.4), PIXRACER-FMU-R12 (27 pins)
GND: PIXRACER-SERIALS-R12 (20 pins), PIXRACER-SD-USB-R12 (18 pins), PIXRACER-POWER-R12 (17 pins), PIXRACER-FMU-R12 (30 pins), PIXRACER-IMU-R12 (33 pins)
8266_CTS: PIXRACER-SERIALS-R12 (ESP8266.10), PIXRACER-FMU-R12 (U301.41)
8266_GPIO0: PIXRACER-SERIALS-R12 (ESP8266.6), PIXRACER-FMU-R12 (U301.1)
8266_GPIO2: PIXRACER-SERIALS-R12 (ESP8266.4), PIXRACER-FMU-R12 (U301.90)
8266_PD: PIXRACER-SERIALS-R12 (ESP8266.3), PIXRACER-FMU-R12 (U301.4)
8266_RST: PIXRACER-SERIALS-R12 (ESP8266.5), PIXRACER-FMU-R12 (U301.5)
8266_RTS: PIXRACER-SERIALS-R12 (ESP8266.9), PIXRACER-FMU-R12 (U301.67)
20608_CS: PIXRACER-FMU-R12 (U301.9), PIXRACER-IMU-R12 (U500.5)
20608_DRDY: PIXRACER-FMU-R12 (U301.8), PIXRACER-IMU-R12 (U500.6)
ALARM: PIXRACER-POWER-R12 (R130.2), PIXRACER-FMU-R12 (U301.77)
BARO_CS: PIXRACER-FMU-R12 (U301.88), PIXRACER-IMU-R12 (U503.5)
BATT_CURRENT_SENS: PIXRACER-SD-USB-R12 (R422.1), PIXRACER-FMU-R12 (U301.26)
BATT_VOLT_SENS: PIXRACER-SD-USB-R12 (R423.1), PIXRACER-FMU-R12 (U301.25)
BUZZER+: PIXRACER-SERIALS-R12 (BUT/BUZ.5), PIXRACER-POWER-R12 (R132.1)
BUZZER-: PIXRACER-SERIALS-R12 (BUT/BUZ.4), PIXRACER-POWER-R12 (Q100.1)
CAN1_RX: PIXRACER-SD-USB-R12 (U10.4), PIXRACER-FMU-R12 (U301.81)
CAN1_TX: PIXRACER-SD-USB-R12 (U10.1), PIXRACER-FMU-R12 (U301.82)
FMU_CH1: PIXRACER-SERIALS-R12 (SERVO_1_6.1), PIXRACER-FMU-R12 (U301.45)
FMU_CH2: PIXRACER-SERIALS-R12 (SERVO_1_6.2), PIXRACER-FMU-R12 (U301.44)
FMU_CH3: PIXRACER-SERIALS-R12 (SERVO_1_6.3), PIXRACER-FMU-R12 (U301.42)
FMU_CH4: PIXRACER-SERIALS-R12 (SERVO_1_6.4), PIXRACER-FMU-R12 (U301.40)
FMU_CH5: PIXRACER-SERIALS-R12 (SERVO_1_6.5), PIXRACER-FMU-R12 (U301.60)
FMU_CH6: PIXRACER-SERIALS-R12 (SERVO_1_6.6), PIXRACER-FMU-R12 (U301.61)
FMU_I2C1_SCL: PIXRACER-SERIALS-R12 (GPS_PORT.4 R202.2), PIXRACER-FMU-R12 (U301.95)
FMU_I2C1_SDA: PIXRACER-SERIALS-R12 (GPS_PORT.5 R203.2), PIXRACER-FMU-R12 (U301.96)
FMU_LED_BLUE: PIXRACER-POWER-R12 (R113.1), PIXRACER-FMU-R12 (U301.89)
FMU_LED_GREEN: PIXRACER-POWER-R12 (R114.1), PIXRACER-FMU-R12 (U301.36)
FMU_LED_RED: PIXRACER-POWER-R12 (R115.1), PIXRACER-FMU-R12 (U301.48)
FMU_RC_INPUT: PIXRACER-SERIALS-R12 (U1203.7), PIXRACER-FMU-R12 (U301.35 U301.64)
FMU_RC_OUTPUT: PIXRACER-SERIALS-R12 (U1203.6), PIXRACER-FMU-R12 (U301.63)
FMU_USART1_RX: PIXRACER-SERIALS-R12 (ESP8266.1), PIXRACER-FMU-R12 (U301.93)
FMU_USART1_TX: PIXRACER-SERIALS-R12 (ESP8266.8), PIXRACER-FMU-R12 (U301.92)
FMU_USART2_CTS: PIXRACER-SERIALS-R12 (TELEM1.4), PIXRACER-FMU-R12 (U301.84)
FMU_USART2_RTS: PIXRACER-SERIALS-R12 (TELEM1.5), PIXRACER-FMU-R12 (U301.85)
FMU_USART2_RX: PIXRACER-SERIALS-R12 (TELEM1.3), PIXRACER-FMU-R12 (U301.87)
FMU_USART2_TX: PIXRACER-SERIALS-R12 (TELEM1.2), PIXRACER-FMU-R12 (U301.86)
FMU_USART3_CTS: PIXRACER-SERIALS-R12 (TELEM2+OSD.4), PIXRACER-FMU-R12 (U301.58)
FMU_USART3_RTS: PIXRACER-SERIALS-R12 (TELEM2+OSD.5), PIXRACER-FMU-R12 (U301.59)
FMU_USART3_RX: PIXRACER-SERIALS-R12 (TELEM2+OSD.3), PIXRACER-FMU-R12 (U301.56)
FMU_USART3_TX: PIXRACER-SERIALS-R12 (TELEM2+OSD.2), PIXRACER-FMU-R12 (U301.55)
FMU_USART4_RX: PIXRACER-SERIALS-R12 (GPS_PORT.3), PIXRACER-FMU-R12 (U301.24)
FMU_USART4_TX: PIXRACER-SERIALS-R12 (GPS_PORT.2), PIXRACER-FMU-R12 (U301.23)
FMU_USART8_RX: PIXRACER-SERIALS-R12 (U1202.3), PIXRACER-FMU-R12 (U301.97)
FMU_USART8_TX: PIXRACER-SERIALS-R12 (U1202.2), PIXRACER-FMU-R12 (U301.98)
FRAM_MISO: PIXRACER-FMU-R12 (U301.53 U302.2), PIXRACER-IMU-R12 (U503.6)
FRAM_MOSI: PIXRACER-FMU-R12 (U301.54 U302.5), PIXRACER-IMU-R12 (U503.7)
FRAM_SCK: PIXRACER-FMU-R12 (U301.47 U302.6), PIXRACER-IMU-R12 (U503.8)
FrSky_INV: PIXRACER-SERIALS-R12 (U1202.1 U1202.5), PIXRACER-FMU-R12 (U301.69)
HMC5983_CS: PIXRACER-FMU-R12 (U301.46), PIXRACER-IMU-R12 (U502.4)
HMC5983_DRDY: PIXRACER-FMU-R12 (U301.43), PIXRACER-IMU-R12 (U502.15)
LED_SAFETY: PIXRACER-SERIALS-R12 (R403.2), PIXRACER-FMU-R12 (U301.18)
MPU9250_CS: PIXRACER-FMU-R12 (U301.17), PIXRACER-IMU-R12 (U501.22)
MPU9250_DRDY: PIXRACER-FMU-R12 (U301.62), PIXRACER-IMU-R12 (U501.12)
MPU9250_MISO: PIXRACER-FMU-R12 (U301.31), PIXRACER-IMU-R12 (U500.4 U501.9 U502.5)
MPU9250_MOSI: PIXRACER-FMU-R12 (U301.32), PIXRACER-IMU-R12 (U500.3 U501.24 U502.16)
MPU9250_SCK: PIXRACER-FMU-R12 (U301.30), PIXRACER-IMU-R12 (U500.2 U501.23 U502.1)
OTG_FS_DM: PIXRACER-SD-USB-R12 (R441.2), PIXRACER-FMU-R12 (U301.70)
OTG_FS_DP: PIXRACER-SD-USB-R12 (R442.2), PIXRACER-FMU-R12 (U301.71)
RSSI_IN: PIXRACER-SERIALS-R12 (R201.2), PIXRACER-FMU-R12 (U301.16)
SAFETY_SWITCH_IN: PIXRACER-SERIALS-R12 (BUT/BUZ.1 R404.1), PIXRACER-FMU-R12 (U301.33)
SBUS_INV: PIXRACER-SERIALS-R12 (U1203.1 U1203.5), PIXRACER-FMU-R12 (U301.7)
SDIO_CK: PIXRACER-SD-USB-R12 (uSD401.5), PIXRACER-FMU-R12 (U301.80)
SDIO_CMD: PIXRACER-SD-USB-R12 (R411.1 uSD401.3), PIXRACER-FMU-R12 (U301.83)
SDIO_D0: PIXRACER-SD-USB-R12 (R410.1 uSD401.7), PIXRACER-FMU-R12 (U301.65)
SDIO_D1: PIXRACER-SD-USB-R12 (R401.1 uSD401.8), PIXRACER-FMU-R12 (U301.66)
SDIO_D2: PIXRACER-SD-USB-R12 (R413.1 uSD401.1), PIXRACER-FMU-R12 (U301.78)
SDIO_D3: PIXRACER-SD-USB-R12 (R412.1 uSD401.2), PIXRACER-FMU-R12 (U301.79)
SPEKTRUM_POWER: PIXRACER-POWER-R12 (Q101.3), PIXRACER-FMU-R12 (U301.3)
VBUS: PIXRACER-SD-USB-R12 (C401.2 J401.1), PIXRACER-POWER-R12 (D101.2 R102.2 R104.2), PIXRACER-FMU-R12 (U301.68)
VBUS_VALID: PIXRACER-POWER-R12 (R102.1), PIXRACER-FMU-R12 (U301.15)
VDD_3V3_PERIPH: PIXRACER-SERIALS-R12 (ESP8266.7), PIXRACER-POWER-R12 (C119.2 C120.2 Q101.2 U103.5)
VDD_3V3_PERIPH_EN: PIXRACER-POWER-R12 (R118.2 U103.3), PIXRACER-FMU-R12 (U301.34)
VDD_3V3_SENSORS_EN: PIXRACER-FMU-R12 (U301.2), PIXRACER-IMU-R12 (U504.3)
VDD_3V3_SPEKTRUM: PIXRACER-SERIALS-R12 (PPM-RSSI-SBUS-SPEKTRUM.4), PIXRACER-POWER-R12 (Q101.1)
VDD_5V_BRICK: PIXRACER-SD-USB-R12 (POWERBRICK.1 POWERBRICK.2), PIXRACER-POWER-R12 (FR102.1)
VDD_5V_IN: PIXRACER-SD-USB-R12 (R430.2), PIXRACER-POWER-R12 (9 pins), PIXRACER-FMU-R12 (C317.2 U304.1 U304.3), PIXRACER-IMU-R12 (EMI501.1)
VDD_5V_PERIPH: PIXRACER-SERIALS-R12 (7 pins), PIXRACER-SD-USB-R12 (C404.2 CAN1.1 U10.3), PIXRACER-POWER-R12 (FR101.2)
VDD_5V_RECEIVER: PIXRACER-SERIALS-R12 (PPM-RSSI-SBUS-SPEKTRUM.1), PIXRACER-POWER-R12 (FR106.2)
VDD_5V_SENS: PIXRACER-SD-USB-R12 (R430.1 R431.1), PIXRACER-FMU-R12 (U301.29)
VDD_BRICK_VALID: PIXRACER-POWER-R12 (R103.2 R105.1), PIXRACER-FMU-R12 (U301.91)